# Altium schematic sheet BI3_Connector.SchDoc
size A4; DocumentNumber: 2; SheetNumber: 2; SheetTotal: 7
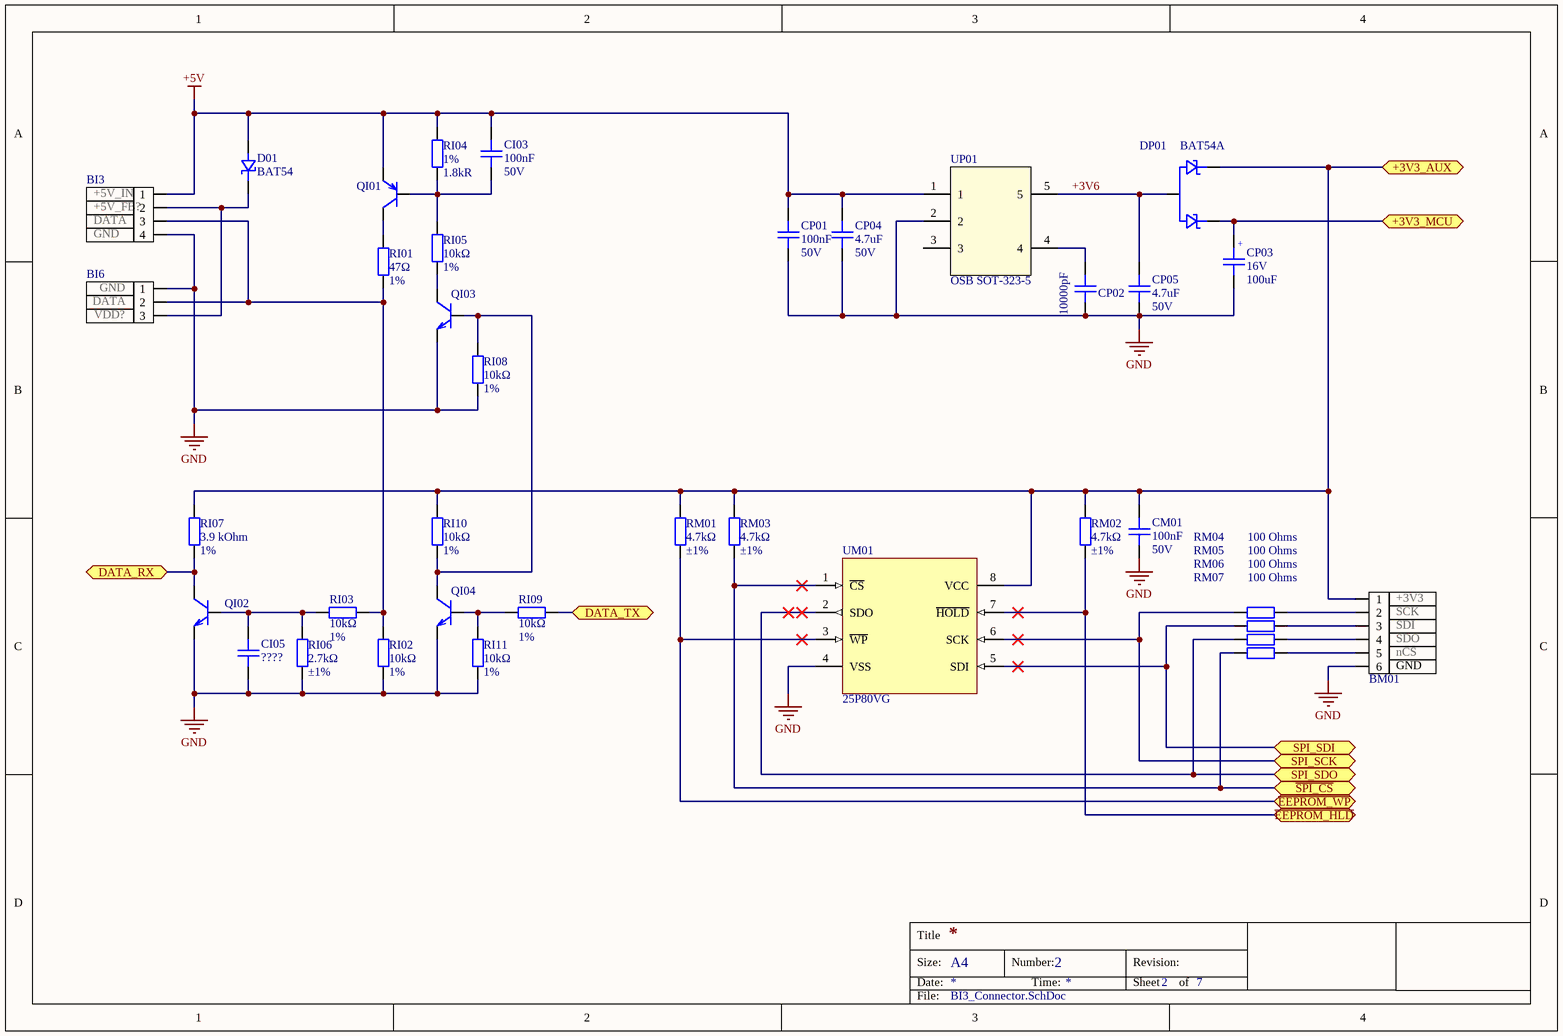
[diagram p0: BI3_Connector.SchDoc]

## Parts
BI3  pin_1: +5V_IN  pin_2: +5V_FB?  pin_3: DATA  pin_4: GND
BI6  pin_1: GND  pin_2: DATA  pin_3: VDD?  [CONN_S3B-ZR_JST]
BM01  pin_1: +3V3  pin_2: SCK  pin_3: SDI  pin_4: SDO  pin_5: nCS  pin_6: GND
CI03  Capacitance: 100nF  Voltage Rating: 50V  [CAPC1608X08N_0603]  (hidden comment: CAP CER 0.1uF ±10% 50V X7R 0603)
CI05  value ????  [CAP_0603]  (hidden comment: CC0603KRX7R0BB103)
CM01  Capacitance: 100nF  Voltage Rating: 50V  [CAPC1608X08N_0603]  (hidden comment: CAP CER 0.1uF ±10% 50V X7R 0603)
CP01  Capacitance: 100nF  Voltage Rating: 50V  [CAPC1608X08N_0603]  (hidden comment: CAP CER 0.1uF ±10% 50V X7R 0603)
CP02  value 10000pF  [CAP_0603]  (hidden comment: CC0603KRX7R0BB103)
CP03  Voltage Rating: 16V  Capacitance: 100uF  [WCAP-ASLI_5x5.5]  (hidden comment: CAP ALUM 100 UF 20% 6.3 V SMD)
CP04  Capacitance: 4.7uF  Voltage Rating: 50V  [CAPC2012X14N]  (hidden comment: CAP CER 4.7UF 50V X5R 0805)
CP05  Capacitance: 4.7uF  Voltage Rating: 50V  [CAPC2012X14N]  (hidden comment: CAP CER 4.7UF 50V X5R 0805)
D01  BAT54  [SOT100P240X120-3N]
DP01  BAT54A  [SOT100P240X120-3N]
QI01  (no value)
QI02  BC847CW,115  [SOT-323]  (value not drawn)
QI03  BC847CW,115  [SOT-323]  (value not drawn)
QI04  BC847CW,115  [SOT-323]  (value not drawn)
RI01  Resistance: 47Ω  Tolerance: 1%  [Resistor-0603]  (hidden comment: R 47Ω ±1% 0603 0.1W)
RI02  Resistance: 10kΩ  Tolerance: 1%  [R0603]  (hidden comment: RES SMD 10K OHM 1% 1/10W 0603)
RI03  Resistance: 10kΩ  Tolerance: 1%  [R0603]  (hidden comment: RES SMD 10K OHM 1% 1/10W 0603)
RI04  Tolerance: 1%  Resistance: 1.8kR  [R0603]  (hidden comment: RES SMD 1.47K OHM 1% 1/10W 0603)
RI05  Resistance: 10kΩ  Tolerance: 1%  [R0603]  (hidden comment: RES SMD 10K OHM 1% 1/10W 0603)
RI06  Resistance: 2.7kΩ  Tolerance: ±1%  [Resistor-0603]  (hidden comment: R 2.2kΩ ±1% 0603 0.1W)
RI07  Resistance: 3.9 kOhm  Tolerance: 1%  [R0603]  (hidden comment: RES SMD 7.5K OHM 1% 1/10W 0603)
RI08  Resistance: 10kΩ  Tolerance: 1%  [R0603]  (hidden comment: RES SMD 10K OHM 1% 1/10W 0603)
RI09  Resistance: 10kΩ  Tolerance: 1%  [R0603]  (hidden comment: RES SMD 10K OHM 1% 1/10W 0603)
RI10  Resistance: 10kΩ  Tolerance: 1%  [R0603]  (hidden comment: RES SMD 10K OHM 1% 1/10W 0603)
RI11  Resistance: 10kΩ  Tolerance: 1%  [R0603]  (hidden comment: RES SMD 10K OHM 1% 1/10W 0603)
RM01  Resistance: 4.7kΩ  Tolerance: ±1%  [Resistor-0603]
RM02  Resistance: 4.7kΩ  Tolerance: ±1%  [Resistor-0603]
RM03  Resistance: 4.7kΩ  Tolerance: ±1%  [Resistor-0603]
RM04  100 Ohms  [R_0603]
RM05  100 Ohms  [R_0603]
RM06  100 Ohms  [R_0603]
RM07  100 Ohms  [R_0603]
UM01  25P80VG
UP01  OSB SOT-323-5

## Ports
+3V3_AUX, +3V3_MCU, DATA_RX, DATA_TX, SPI_SCK, SPI_SDI, SPI_SDO, ~{EEPROM_HLD}, ~{EEPROM_WP}, ~{SPI_CS}

## Nets
+5V: BI3.1 CI03.2 CP01.2 CP04.2 D01.1 QI01.2(E) RI04.2 UP01.1
GND: BI3.4 BI6.1 BM01.6 CI05.1 CM01.1 CP01.1 CP02.1 CP03.2 CP04.1 CP05.1 QI02.2(E) QI03.2(E) QI04.2(E) RI02.1 RI06.2 RI08.1 RI11.1 UM01.4(VSS) UP01.2
+3V3_AUX: BM01.1 CM01.2 DP01.2 RI07.1 RI10.1 RM01.2 RM02.2 RM03.2 UM01.8(VCC) ; port +3V3_AUX
+3V3_MCU: CP03.1 DP01.1 ; port +3V3_MCU
+3V6: CP05.2 DP01.3 UP01.5
~{EEPROM_HLD}: RM02.1 UM01.7(~{HOLD}) ; port ~{EEPROM_HLD}
~{EEPROM_WP}: RM01.1 UM01.3(~{WP}) ; port ~{EEPROM_WP}
~{SPI_CS}: RM03.1 RM07.2 UM01.1(~{CS}) ; port ~{SPI_CS}
DATA_RX: QI02.3(C) RI07.2 ; port DATA_RX
DATA_TX: RI09.1 ; port DATA_TX
SPI_SCK: RM04.2 UM01.6(SCK) ; port SPI_SCK
SPI_SDI: RM05.2 UM01.5(SDI) ; port SPI_SDI
SPI_SDO: RM06.2 UM01.2(SDO) ; port SPI_SDO
NetBI3_2: BI3.2 BI6.3 D01.3
NetBI3_3: BI3.3 BI6.2 RI01.1 RI02.2 RI03.2
NetBM01_2: BM01.2 RM04.1
NetBM01_3: BM01.3 RM05.1
NetBM01_4: BM01.4 RM06.1
NetBM01_5: BM01.5 RM07.1
NetCI03_1: CI03.1 QI01.1(B) RI04.1 RI05.2
NetCI05_2: CI05.2 QI02.1(B) RI03.1 RI06.1
NetCP02_2: CP02.2 UP01.4
NetQI01_3: QI01.3(C) RI01.2
NetQI03_1: QI03.1(B) QI04.3(C) RI08.2 RI10.2
NetQI03_3: QI03.3(C) RI05.1
NetQI04_1: QI04.1(B) RI09.2 RI11.2

Not connected (* = marked no-connect by the designer): UP01 3

## Notes on the sheet
- Title
- Size:
- Date:
- A4
- Number:
- Time:
- Revision:
- Sheet
- of
- File:
- (in symbol CAP ALUM 100 UF 20% 6.3 V SMD) +

## Library data of the parts
BI3 = CONN HEADER R/A 4POS 2MM: Connector Header Through Hole, Right Angle 4 position 0.079" (2.00mm); Manufacturer: Molex; Manufacturer Part Number: 53254-0470; Gender: Male; Current Rating: 2A; Voltage Rating: 125V; Number of Contacts: 4; Pitch: 2mm; Glow Wire Compliant: Non-compliant; Supplier 1: Digi-Key; Stock 1: 2306; Pricing 1: 1=0.28, 10=0.259, 100=0.1794, 500=0.1518, 1000=0.1242, 5000=0.1104, 10000=0.1001 (USD); Mount: Through Hole; Contact Plating: Tin; Contact Material: Brass; Housing Material: Nylon; Color: Natural; Min Operating Temperature: -40°C; Max Operating Temperature: 105°C; Packaging: Tray; Termination: Through Hole; Number of Rows: 1; Package Quantity: 2000; Number of Positions: 4; Orientation: Right Angle; Voltage Rating (DC): 125V; Number of Circuits: 4; Radiation Hardening: No; REACH SVHC: Unknown; Flammability Rating: UL94 V-0; ComponentLink1URL: http://www.molex.com/webdocs/datasheets/pdf/en-us/0532540470_PCB_HEADERS.pdf?src-supplier=Avnet+Europe; ComponentLink1Description: http://www.molex.com/webdocs/datasheets/pdf/en-us/0532540470_PCB_HEADERS.pdf?src-supplier=Avnet+Europe; ComponentLink2URL: http://www.mouser.com/ds/2/276/0532540470_PCB_HEADERS-229262.pdf?src-supplier=Mouser; ComponentLink2Description: http://www.mouser.com/ds/2/276/0532540470_PCB_HEADERS-229262.pdf?src-supplier=Mouser; Supplier Part Number 1: WM19001-ND
BI6 = CONN HEADER TH R/A 3POS 1.5MM: Connector Header Through Hole, Right Angle 3 position 0.059" (1.50mm); Manufacturer: JST; Manufacturer Part Number: S3B-ZR(LF)(SN); Body Plating: Tin; Current Rating: 1A; Contact Resistance: 30mR; Voltage Rating: 50V; Number of Positions: 3; Gender: Male; Connector Type: Male Pin; Insulation Resistance: 500MR; Pitch: 1.5mm; Panel Thickness: 3.5mm; Supplier 1: Digi-Key; Stock 1: 0; Pricing 1: 1=0.2, 10=0.184, 100=0.1274, 500=0.1078, 1000=0.0882, 5000=0.0784, 10000=0.071 (USD); Mount: Through Hole; Number of Pins: 3; Contact Material: Brass,Copper,Tin; Color: Natural,White; Contact Plating: Tin,Copper; Housing Color: Beige; Housing Material: Polyamide; Material: Nylon; Min Operating Temperature: -25°C; Max Operating Temperature: 85°C; Number of Rows: 1; Packaging: Bulk; Max Current Rating: 1A; Termination: Press-Fit; Fastening Type: Detent; Number of Contacts: 3; Max Voltage Rating (AC): 50V; Orientation: Right Angle; Voltage Rating (AC): 50V; Voltage Rating (DC): 50V; Length: 6mm; Height: 7.2mm; Width: 3.5mm; Depth: 6mm; Lead Pitch: 1.5mm; Contact Mating Length: 0.094inch; Lead Free: Lead Free; REACH SVHC: No SVHC; Flammability Rating: UL94 V-0; ComponentLink1URL: http://www.jst-mfg.com/product/pdf/eng/eZH.pdf?src-supplier=Digi-Key; ComponentLink1Description: http://www.jst-mfg.com/product/pdf/eng/eZH.pdf?src-supplier=Digi-Key; ComponentLink2URL: https://www.verical.com/server-webapp/html/getDatasheet?partID=722697&src-supplier=Verical; ComponentLink2Description: https://www.verical.com/server-webapp/html/getDatasheet?partID=722697&src-supplier=Verical; ComponentLink3URL: http://www.produktinfo.conrad.com/datenblaetter/725000-749999/741155-da-01-en-STIFTLEISTE_GEWINKELT_3_POL_RM1_5.pdf?src-supplier=Conrad; ComponentLink3Description: http://www.produktinfo.conrad.com/datenblaetter/725000-749999/741155-da-01-en-STIFTLEISTE_GEWINKELT_3_POL_RM1_5.pdf?src-supplier=Conrad; Supplier Part Number 1: 455-1670-ND
BM01 = CONN HEADER EC 6POS
CI03 CM01 CP01 = CAP CER 0.1uF ±10% 50V X7R 0603: Capacitor; Manufacturer: KEMET; Manufacturer Part Number: C0603C104M5RACTU; Dielectric Material: Ceramic; Tolerance: 20%; Dissipation Factor: 2.5%; Supplier 1: Digi-Key; Stock 1: 1202175; Pricing 1: 1=0.1, 10=0.039, 50=0.0204, 100=0.0174, 500=0.0124, 1000=0.0097 (USD); Mount: Surface Mount,PCB; Case/Package: 0603; Case Code (Metric): 1608; Case Code (Imperial): 0603; Contact Plating: Tin,Matte; Min Operating Temperature: -55°C; Max Operating Temperature: 125°C; Package Quantity: 1; Packaging: Tape and Reel; Voltage Rating (DC): 50V; Dielectric: X7R; Termination: SMD/SMT; Length: 1.6mm; Height: 0.8mm; Width: 0.031inch; Thickness: 0.034inch; Lead Pitch: 0.7mm; Depth: 0.8mm; Radiation Hardening: No; REACH SVHC: No SVHC; ComponentLink1URL: http://www.farnell.com/datasheets/2746056.pdf?src-supplier=Element14; ComponentLink1Description: http://www.farnell.com/datasheets/2746056.pdf?src-supplier=Element14; ComponentLink2URL: http://www.mouser.com/ds/2/212/KEM_C1002_X7R_SMD-1102033.pdf?src-supplier=Mouser; ComponentLink2Description: http://www.mouser.com/ds/2/212/KEM_C1002_X7R_SMD-1102033.pdf?src-supplier=Mouser; ComponentLink3URL: https://www.verical.com/server-webapp/html/getDatasheet?partID=626892&src-supplier=Verical; ComponentLink3Description: https://www.verical.com/server-webapp/html/getDatasheet?partID=626892&src-supplier=Verical; ComponentLink4URL: http://components.arrow.com/part/dataview/40911037S8853915N7429?src-supplier=Arrow; ComponentLink4Description: http://components.arrow.com/part/dataview/40911037S8853915N7429?src-supplier=Arrow; ComponentLink5URL: http://capacitoredge.kemet.com/capedge2/DataSheet?pn=C0603C104M5RAC7867&src-supplier=Avnet; ComponentLink5Description: http://capacitoredge.kemet.com/capedge2/DataSheet?pn=C0603C104M5RAC7867&src-supplier=Avnet; ComponentLink6URL: http://capacitoredge.kemet.com/capedge2/DataSheet?pn=C0603C104M5RAC7867&src-supplier=Avnet+Asia; ComponentLink6Description: http://capacitoredge.kemet.com/capedge2/DataSheet?pn=C0603C104M5RAC7867&src-supplier=Avnet+Asia; ComponentLink7URL: http://www.farnell.com/datasheets/2746056.pdf?src-supplier=Farnell; ComponentLink7Description: http://www.farnell.com/datasheets/2746056.pdf?src-supplier=Farnell; ComponentLink8URL: http://www.farnell.com/datasheets/2746056.pdf?src-supplier=Newark; ComponentLink8Description: http://www.farnell.com/datasheets/2746056.pdf?src-supplier=Newark; ComponentLink9URL: http://www.alliedelec.com/m/d/6f3b5eb83d09db50ed28bdc730567b33.pdf?src-supplier=Allied+Electronics; ComponentLink9Description: http://www.alliedelec.com/m/d/6f3b5eb83d09db50ed28bdc730567b33.pdf?src-supplier=Allied+Electronics; ComponentLink10URL: https://api.kemet.com/component-edge/download/datasheet/C0603C104M5RACTU.pdf?src-supplier=Digi-Key; ComponentLink10Description: https://api.kemet.com/component-edge/download/datasheet/C0603C104M5RACTU.pdf?src-supplier=Digi-Key; ComponentLink11URL: http://www.farnell.com/datasheets/2315113.pdf?src-supplier=Newark; ComponentLink11Description: http://www.farnell.com/datasheets/2315113.pdf?src-supplier=Newark; ComponentLink12URL: http://www.farnell.com/datasheets/1828800.pdf?src-supplier=Newark; ComponentLink12Description: http://www.farnell.com/datasheets/1828800.pdf?src-supplier=Newark; ComponentLink13URL: http://components.arrow.com/part/dataview/0323_00313986?src-supplier=Arrow+Europe; ComponentLink13Description: http://components.arrow.com/part/dataview/0323_00313986?src-supplier=Arrow+Europe; ComponentLink14URL: https://www.verical.com/server-webapp/html/getDatasheet?partID=110138&src-supplier=Verical; ComponentLink14Description: https://www.verical.com/server-webapp/html/getDatasheet?partID=110138&src-supplier=Verical; Supplier Part Number 1: 399-7845-1-ND
CI05 CP02 = CAP_CER_10000PF_100V_X7R_0603: 10000pF ±10% 100V Ceramic Capacitor X7R 0603 (1608 Metric); Manufacturer: Yageo; Link: https://www.digikey.com/product-detail/en/yageo/CC0603KRX7R0BB103/311-1788-1-ND/5195690; Digi-KeyPartNumber: 311-1788-1-ND; PartNumber: CC0603KRX7R0BB103
CP03 = CAP ALUM 100 UF 20% 6.3 V SMD: 100µF 6.3V Aluminum Electrolytic Capacitors Radial, Can - SMD  2000 Hrs @ 105°C; Manufacturer Part Number: 865080142007; Manufacturer: Wurth Elektronik; Dissipation Factor: 24%; Endurance: 2000h; Leakage Current: 6.3uA; Ripple Current: 170mA; Capacitance Tolerance: +/-20%; Technical Reference: ASEC055101M6R3DVCTBB000; Polarity: Polar; Impedance: 800mR; Life (Hours): 2000Hour; ComponentLink1Description: Manufacturer; ComponentLink1URL: http://www.we-online.de; ComponentLink2Description: Datasheet; ComponentLink2URL: https://www.we-online.com/catalog/datasheet/865080142007.pdf; Height: 5.5mm; Mounting Technology: SMT; Operating Temperature: -55 to +105degC; Packaging: Tape and Reel; Published Date: May 2020; Diameter: 5mm; Supplier 1: Digi-Key; Stock 1: 2227; Pricing 1: 1=0.2, 50=0.167, 100=0.145, 250=0.129, 500=0.113 (USD); Mount: Surface Mount; Case/Package: Radial; Min Operating Temperature: -55°C; Max Operating Temperature: 105°C; Package Quantity: 1000; Ripple Current (AC): 170mA; Tolerance: 20%; Voltage Rating (DC): 6.3V; Height - Seated (Max): 0.217inch; REACH SVHC: Unknown; ComponentLink3URL: http://www.farnell.com/datasheets/1880090.pdf?src-supplier=Farnell; ComponentLink3Description: http://www.farnell.com/datasheets/1880090.pdf?src-supplier=Farnell; ComponentLink4URL: http://www.farnell.com/datasheets/1880090.pdf?src-supplier=Newark; ComponentLink4Description: http://www.farnell.com/datasheets/1880090.pdf?src-supplier=Newark; ComponentLink5URL: http://katalog.we-online.de/pbs/datasheet/865080142007.pdf?src-supplier=Digi-Key; ComponentLink5Description: http://katalog.we-online.de/pbs/datasheet/865080142007.pdf?src-supplier=Digi-Key; ComponentLink6URL: http://www.farnell.com/datasheets/1880090.pdf?src-supplier=Element14; ComponentLink6Description: http://www.farnell.com/datasheets/1880090.pdf?src-supplier=Element14; ComponentLink7URL: https://katalog.we-online.de/pbs/datasheet/865080142007.pdf?src-supplier=Digi-Key; ComponentLink7Description: https://katalog.we-online.de/pbs/datasheet/865080142007.pdf?src-supplier=Digi-Key; Supplier Part Number 1: 732-8472-1-ND
CP04 CP05 = CAP CER 4.7UF 50V X5R 0805: 4.7µF ±10% 50V Ceramic Capacitor X5R 0805 (2012 Metric); Manufacturer: Samsung; Manufacturer Part Number: CL21A475KBQNNNE; Supplier 1: Digi-Key; Stock 1: 896091; Pricing 1: 1=0.27, 10=0.184, 50=0.1224, 100=0.1041, 500=0.0735, 1000=0.0643 (USD); Mount: Surface Mount; Case/Package: 0805; Case Code (Metric): 2012; Case Code (Imperial): 0805; Min Operating Temperature: -55°C; Max Operating Temperature: 85°C; Tolerance: 10%; Package Quantity: 1; Packaging: Tape and Reel; Dielectric: X5R; Length: 2mm; Width: 0.049inch; Thickness: 0.055inch; Depth: 1.25mm; Radiation Hardening: No; ComponentLink1URL: http://www.samsungsem.com/kr/support/product-search/mlcc/CL21A475KBQNNNE.jsp?src-supplier=Digi-Key; ComponentLink1Description: http://www.samsungsem.com/kr/support/product-search/mlcc/CL21A475KBQNNNE.jsp?src-supplier=Digi-Key; ComponentLink2URL: https://www.verical.com/server-webapp/html/getDatasheet?partID=470982&src-supplier=Verical; ComponentLink2Description: https://www.verical.com/server-webapp/html/getDatasheet?partID=470982&src-supplier=Verical; ComponentLink3URL: http://www1.futureelectronics.com/doc/SAMSUNG/CL21A475KBQNNNE.pdf?src-supplier=Future+Electronics; ComponentLink3Description: http://www1.futureelectronics.com/doc/SAMSUNG/CL21A475KBQNNNE.pdf?src-supplier=Future+Electronics; Supplier Part Number 1: 1276-1248-1-ND
D01 = BAT54: Schottky DiodeS
DP01 = BAT54A: 410mV Forward, 70v Reverse, 1A/250mW Series Schottky Diode
QI01 = BC857BW: Bipolar (BJT) Transistor PNP
QI02 QI03 QI04 = TRANS BC847CW,115 NPN 45V 0.1A SOT323: Bipolar (BJT) Transistor NPN 45V 100mA 100MHz 200mW Surface Mount SOT-323-3; Manufacturer: Nexperia; Supplier 1: Digi-Key; Manufacturer Part Number: BC847CW,115; Stock 1: 327256; Pricing 1: 1=0.13, 10=0.118, 25=0.1124, 100=0.0495, 250=0.0475, 500=0.0389, 1000=0.027 (USD); ComponentLink1URL: http://www.farnell.com/datasheets/1856333.pdf?src-supplier=Farnell; ComponentLink1Description: http://www.farnell.com/datasheets/1856333.pdf?src-supplier=Farnell; ComponentLink2URL: http://www.farnell.com/datasheets/1856333.pdf?src-supplier=Element14; ComponentLink2Description: http://www.farnell.com/datasheets/1856333.pdf?src-supplier=Element14; ComponentLink3URL: https://assets.nexperia.com/documents/data-sheet/BC847_SER.pdf?src-supplier=Digi-Key; ComponentLink3Description: https://assets.nexperia.com/documents/data-sheet/BC847_SER.pdf?src-supplier=Digi-Key; ComponentLink4URL: http://www.farnell.com/datasheets/1856333.pdf?src-supplier=Newark; ComponentLink4Description: http://www.farnell.com/datasheets/1856333.pdf?src-supplier=Newark; Supplier Part Number 1: 1727-4312-1-ND
RI01 = R 47Ω ±1% 0603 0.1W: Resistor; Manufacturer: Yageo; Manufacturer Part Number: AC0603FR-0747RL; Temperature Coefficient: 100ppm/°C; Power Rating: 100mW; Voltage Rating: 50V; Supplier 1: Digi-Key; Stock 1: 51634; Pricing 1: 1=0.1, 10=0.029, 100=0.0118, 1000=0.0053, 2500=0.0046 (USD); Case/Package: 0603; Weight: 7.1E-05oz; Case Code (Metric): 1608; Case Code (Imperial): 0603; Min Operating Temperature: -55°C; Max Operating Temperature: 155°C; Packaging: Tape and Reel; Composition: Thick Film; Number of Terminations: 2; Max Power Dissipation: 100mW; Package Quantity: 1; Termination: SMD/SMT; Features: Moisture Resistant,Automotive AEC-Q200,Anti-Sulfur; Length: 0.063inch; Height: 0.022inch; Width: 0.031inch; Lead Free: Lead Free; ComponentLink1URL: http://www.yageo.com/NewPortal/yageodocoutput?fileName=/pdf/R-Chip/PYu-AC_51_RoHS_L_6.pdf&src-supplier=Mouser; ComponentLink1Description: http://www.yageo.com/NewPortal/yageodocoutput?fileName=/pdf/R-Chip/PYu-AC_51_RoHS_L_6.pdf&src-supplier=Mouser; Supplier Part Number 1: 311-47LDCT-ND
RI02 RI03 RI05 RI08 RI09-RI11 = RES SMD 10K OHM 1% 1/10W 0603: 10 kOhms ±1% 0.1W, 1/10W Chip Resistor 0603 (1608 Metric)  Thick Film; Manufacturer: Yageo; Manufacturer Part Number: RC0603FR-0710KL; Temperature Coefficient: 100ppm/°C; Voltage Rating: 75V; Power Rating: 100mW; Voltage Rating (DC): 50V; Supplier 1: Digi-Key; Stock 1: 81498627; Pricing 1: 1=0.1, 10=0.024, 100=0.0097, 1000=0.0044, 2500=0.0038 (USD); Case/Package: 0603; Number of Pins: 2; Weight: 7.1E-05oz; Case Code (Imperial): 0603; Case Code (Metric): 1608; Min Operating Temperature: -55°C; Max Operating Temperature: 155°C; Packaging: Tape and Reel; Composition: Thick Film; Military Standard: Not; Termination: SMD/SMT; Length: 1.6mm; Height: 0.45mm; Width: 0.8mm; Depth: 0.8mm; Lead Pitch: 0.3mm; Lead Free: Lead Free; REACH SVHC: No SVHC; ComponentLink1URL: http://www.farnell.com/datasheets/38590.pdf?src-supplier=Element14; ComponentLink1Description: http://www.farnell.com/datasheets/38590.pdf?src-supplier=Element14; ComponentLink2URL: https://www.verical.com/server-webapp/html/getDatasheet?partID=409289&src-supplier=Verical; ComponentLink2Description: https://www.verical.com/server-webapp/html/getDatasheet?partID=409289&src-supplier=Verical; ComponentLink3URL: http://www.farnell.com/datasheets/1868787.pdf?src-supplier=Element14; ComponentLink3Description: http://www.farnell.com/datasheets/1868787.pdf?src-supplier=Element14; ComponentLink4URL: http://www.farnell.com/datasheets/2167052.pdf?src-supplier=Element14; ComponentLink4Description: http://www.farnell.com/datasheets/2167052.pdf?src-supplier=Element14; ComponentLink5URL: http://www.farnell.com/datasheets/443971.pdf?src-supplier=Element14; ComponentLink5Description: http://www.farnell.com/datasheets/443971.pdf?src-supplier=Element14; Supplier Part Number 1: 311-10.0KHRCT-ND
RI04 = RES SMD 1.47K OHM 1% 1/10W 0603: 1.47 kOhms ±1% 0.1W, 1/10W Chip Resistor 0603 (1608 Metric)  Thick Film; Manufacturer: Yageo; Manufacturer Part Number: RC0603FR-071K47L; Max Power Dissipation: 100mW; Temperature Coefficient: 100ppm/°C; Voltage Rating (DC): 50V; Voltage Rating: 75V; Supplier 1: Digi-Key; Stock 1: 354350; Pricing 1: 1=0.1, 10=0.021, 100=0.0085, 1000=0.0038, 2500=0.0033 (USD); Case/Package: 0603; Case Code (Metric): 1608; Case Code (Imperial): 0603; Min Operating Temperature: -55°C; Max Operating Temperature: 155°C; Packaging: Tape and Reel; Number of Terminations: 2; Package Quantity: 1; Features: Moisture Resistant; Power Rating: 100mW; Military Standard: Not; Length: 1.6mm; Height: 0.022inch; Width: 0.8mm; Depth: 0.8mm; Lead Free: Lead Free; ComponentLink1URL: http://www.yageo.com/documents/recent/PYu-RC_Group_51_RoHS_L_9.pdf?src-supplier=Digi-Key; ComponentLink1Description: http://www.yageo.com/documents/recent/PYu-RC_Group_51_RoHS_L_9.pdf?src-supplier=Digi-Key; ComponentLink2URL: http://www.yageo.com/documents/recent/PYu-RC_Group_51_RoHS_L_10.pdf?src-supplier=Digi-Key; ComponentLink2Description: http://www.yageo.com/documents/recent/PYu-RC_Group_51_RoHS_L_10.pdf?src-supplier=Digi-Key; Supplier Part Number 1: 311-1.47KHRCT-ND; Weight: 7.1E-05oz; Resistor Type: Thick Film; Termination: SMD/SMT; Mount: Surface Mount
RI06 = R 2.2kΩ ±1% 0603 0.1W: Resistor; Manufacturer: Yageo; Manufacturer Part Number: AC0603FR-072K2L; Temperature Coefficient: 100ppm/°C; Voltage Rating: 50V; Power Rating: 100mW; Supplier 1: Digi-Key; Stock 1: 604704; Pricing 1: 1=0.1, 10=0.029, 100=0.0118, 1000=0.0053, 2500=0.0046 (USD); Case/Package: 0603; Case Code (Imperial): 0603; Case Code (Metric): 1608; Min Operating Temperature: -55°C; Max Operating Temperature: 155°C; Packaging: Tape and Reel; Composition: Thick Film; Military Standard: Not; Termination: SMD/SMT; Length: 0.063inch; Height: 0.022inch; Width: 0.031inch; Depth: 0.8mm; Lead Free: Lead Free; ComponentLink1URL: http://www.yageo.com/NewPortal/yageodocoutput?fileName=/pdf/R-Chip/PYu-AC_51_RoHS_L_6.pdf&src-supplier=Mouser; ComponentLink1Description: http://www.yageo.com/NewPortal/yageodocoutput?fileName=/pdf/R-Chip/PYu-AC_51_RoHS_L_6.pdf&src-supplier=Mouser; Supplier Part Number 1: 311-2.2KLDCT-ND; Package Quantity: 1; Number of Terminations: 2; Max Power Dissipation: 100mW; Features: Moisture Resistant,Automotive AEC-Q200,Anti-Sulfur
RI07 = RES SMD 7.5K OHM 1% 1/10W 0603: 7.5 kOhms ±1% 0.1W, 1/10W Chip Resistor 0603 (1608 Metric) Moisture Resistant Thick Film; Manufacturer: Yageo; Manufacturer Part Number: RC0603FR-077K5L; Temperature Coefficient: 100ppm/°C; Voltage Rating: 50V; Power Rating: 100mW; Working Voltage: 75V; Supplier 1: Digi-Key; Stock 1: 1778854; Pricing 1: 1=0.1, 10=0.023, 100=0.0094, 1000=0.0042, 2500=0.0037 (USD); Case/Package: 0603; Number of Pins: 2; Case Code (Imperial): 0603; Case Code (Metric): 1608; Min Operating Temperature: -55°C; Max Operating Temperature: 155°C; Packaging: Tape and Reel; Composition: Thick Film; Military Standard: Not; Termination: SMD/SMT; Voltage Rating (DC): 50V; Length: 1.6mm; Height: 0.45mm; Width: 0.031inch; Depth: 0.8mm; Lead Free: Lead Free; REACH SVHC: No SVHC; ComponentLink1URL: http://www.yageo.com/documents/recent/PYu-RC_Group_51_RoHS_L_10.pdf?src-supplier=Digi-Key; ComponentLink1Description: http://www.yageo.com/documents/recent/PYu-RC_Group_51_RoHS_L_10.pdf?src-supplier=Digi-Key; ComponentLink2URL: http://www.mouser.com/catalog/specsheets/RC0603.pdf?src-supplier=Mouser; ComponentLink2Description: http://www.mouser.com/catalog/specsheets/RC0603.pdf?src-supplier=Mouser; ComponentLink3URL: http://www.farnell.com/datasheets/443971.pdf?src-supplier=Element14; ComponentLink3Description: http://www.farnell.com/datasheets/443971.pdf?src-supplier=Element14; ComponentLink4URL: https://www.verical.com/server-webapp/html/getDatasheet?partID=326523&src-supplier=Verical; ComponentLink4Description: https://www.verical.com/server-webapp/html/getDatasheet?partID=326523&src-supplier=Verical; Supplier Part Number 1: 311-7.50KHRCT-ND; Package Quantity: 1; Number of Terminations: 2; Max Power Dissipation: 100mW; Features: Moisture Resistant
RM01 RM02 RM03 = R 4.7kΩ ±1% 0603 0.1W: Resistor; Manufacturer: Yageo; Manufacturer Part Number: AC0603FR-074K7L; Temperature Coefficient: 100ppm/°C; Power Rating: 100mW; Voltage Rating: 50V; Supplier 1: Digi-Key; Stock 1: 568000; Pricing 1: 1=0.1, 10=0.029, 100=0.0118, 1000=0.0053, 2500=0.0046 (USD); Case/Package: 0603; Case Code (Imperial): 0603; Case Code (Metric): 1608; Min Operating Temperature: -55°C; Max Operating Temperature: 155°C; Packaging: Tape and Reel; Composition: Thick Film; Military Standard: Not; Termination: SMD/SMT; Number of Terminations: 2; Max Power Dissipation: 100mW; Features: Moisture Resistant,Automotive AEC-Q200; Length: 0.063inch; Height: 0.022inch; Width: 0.031inch; Depth: 0.8mm; Lead Free: Lead Free; Supplier Part Number 1: YAG3613CT-ND
RM04 RM05 RM06 RM07 = RES_SMD_100_OHM_1%_1/8W_0603: RES SMD 100 OHM 1% 1/8W 0603; PartNumber: MCT06030C1000FP500; Manufacturer: Vishay Beyschlag; Link: https://www.digikey.com/product-detail/en/vishay-beyschlag/MCT06030C1000FP500/MCT0603-100-CFCT-ND/2607874; Digi-KeyPartNumber: MCT0603-100-CFCT-ND; Value: 100 Ohms
UM01 = IC 25P80VG FLASH 8MBIT SPI 75MHZ 8SO